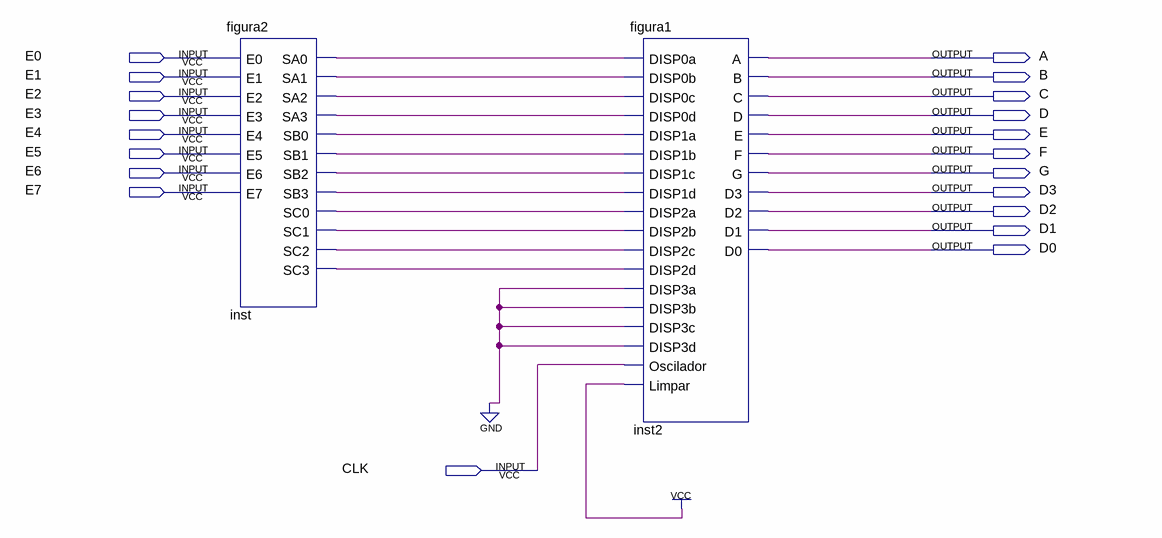
[diagram p0: schematic sheet]
// Quartus schematic Experimento1.bdf as structural Verilog: 2 symbols, 20 pins
module Experimento1 (
  input  E0,
  input  E1,
  input  E2,
  input  E3,
  input  E4,
  input  E5,
  input  E6,
  input  E7,
  input  CLK,
  output A,
  output B,
  output C,
  output D,
  output E,
  output F,
  output G,
  output D3,
  output D2,
  output D1,
  output D0
);

  wire inst_sa0, inst_sa1, inst_sa2, inst_sa3, inst_sb0, inst_sb1, inst_sb2, inst_sb3, inst_sc0, inst_sc1,
       inst_sc2, inst_sc3;

  figura2 inst (
    .E0(E0), .E1(E1), .E2(E2), .E3(E3), .E4(E4), .E5(E5), .E6(E6), .E7(E7), .SA0(inst_sa0), .SA1(inst_sa1),
    .SA2(inst_sa2), .SA3(inst_sa3), .SB0(inst_sb0), .SB1(inst_sb1), .SB2(inst_sb2), .SB3(inst_sb3),
    .SC0(inst_sc0), .SC1(inst_sc1), .SC2(inst_sc2), .SC3(inst_sc3));
  figura1 inst2 (
    .DISP0a(inst_sa0), .DISP0b(inst_sa1), .DISP0c(inst_sa2), .DISP0d(inst_sa3), .DISP1a(inst_sb0),
    .DISP1b(inst_sb1), .DISP1c(inst_sb2), .DISP1d(inst_sb3), .DISP2a(inst_sc0), .DISP2b(inst_sc1),
    .DISP2c(inst_sc2), .DISP2d(inst_sc3), .DISP3a(1'b0), .DISP3b(1'b0), .DISP3c(1'b0), .DISP3d(1'b0),
    .Oscilador(CLK), .Limpar(1'b1), .A(A), .B(B), .C(C), .D(D), .E(E), .F(F), .G(G), .D3(D3), .D2(D2),
    .D1(D1), .D0(D0));
endmodule
